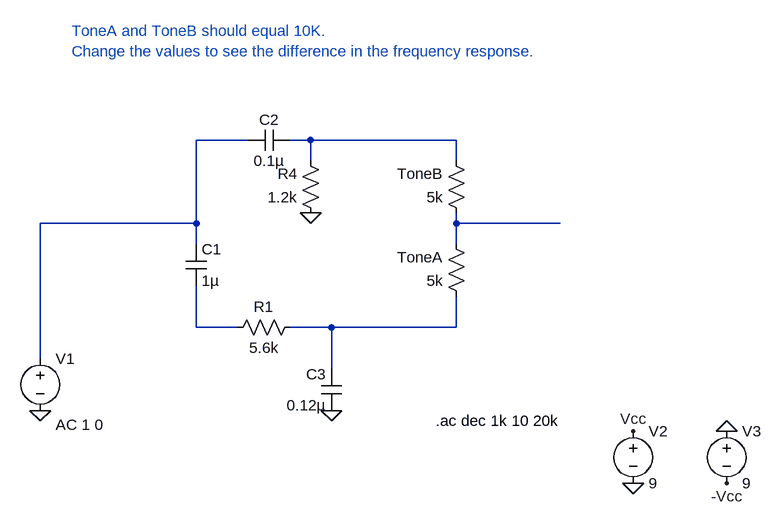
[diagram p0: schematic tone.asc]
tone.asc, the LTspice schematic file:
Version 4
SHEET 1 3044 724
WIRE 336 -464 256 -464
WIRE 432 -464 400 -464
WIRE 656 -464 432 -464
WIRE 432 -432 432 -464
WIRE 656 -432 656 -464
WIRE 256 -336 256 -464
WIRE 256 -336 16 -336
WIRE 656 -336 656 -352
WIRE 816 -336 656 -336
WIRE 256 -304 256 -336
WIRE 656 -304 656 -336
WIRE 256 -176 256 -240
WIRE 320 -176 256 -176
WIRE 464 -176 400 -176
WIRE 656 -176 656 -224
WIRE 656 -176 464 -176
WIRE 16 -128 16 -336
WIRE 464 -112 464 -176
FLAG 928 64 0
FLAG 1072 -16 0
FLAG 928 -16 Vcc
FLAG 1072 64 -Vcc
FLAG 16 -48 0
FLAG 432 -352 0
FLAG 464 -48 0
SYMBOL voltage 928 -32 R0
SYMATTR InstName V2
SYMATTR Value 9
SYMBOL voltage 1072 -32 R0
SYMATTR InstName V3
SYMATTR Value 9
SYMBOL voltage 16 -144 R0
WINDOW 123 24 118 Left 2
SYMATTR Value2 AC 1 0
SYMATTR InstName V1
SYMATTR Value ""
SYMBOL cap 240 -304 R0
SYMATTR InstName C1
SYMATTR Value 1µ
SYMBOL cap 400 -480 R90
WINDOW 0 0 32 VBottom 2
WINDOW 3 32 32 VTop 2
SYMATTR InstName C2
SYMATTR Value 0.1µ
SYMBOL cap 480 -48 R180
WINDOW 0 24 56 Left 2
WINDOW 3 24 8 Left 2
SYMATTR InstName C3
SYMATTR Value 0.12µ
SYMBOL res 416 -192 R90
WINDOW 0 0 56 VBottom 2
WINDOW 3 32 56 VTop 2
SYMATTR InstName R1
SYMATTR Value 5.6k
SYMBOL res 672 -208 R180
WINDOW 0 36 76 Left 2
WINDOW 3 36 40 Left 2
SYMATTR InstName ToneA
SYMATTR Value 5k
SYMBOL res 672 -336 R180
WINDOW 0 36 76 Left 2
WINDOW 3 36 40 Left 2
SYMATTR InstName ToneB
SYMATTR Value 5k
SYMBOL res 448 -336 R180
WINDOW 0 36 76 Left 2
WINDOW 3 36 40 Left 2
SYMATTR InstName R4
SYMATTR Value 1.2k
TEXT 624 -32 Left 2 !.ac dec 1k 10 20k
TEXT 64 -632 Left 2 ;ToneA and ToneB should equal 10K.\nChange the values to see the difference in the frequency response.

The netlist it stands for:
* tone.asc
V2 Vcc 0 9
V3 0 -Vcc 9
V1 N001 0 AC 1 0
C1 N001 N004 1µ
C2 N002 N001 0.1µ
C3 0 N005 0.12µ
R1 N005 N004 5.6k
R§ToneA N005 N003 5k
R§ToneB N003 N002 5k
R4 0 N002 1.2k
.ac dec 1k 10 20k
* ToneA and ToneB should equal 10K.
* Change the values to see the difference in the frequency response.
.backanno
.end